# Altium schematic sheet eMMC FLASH.SchDoc
size A4
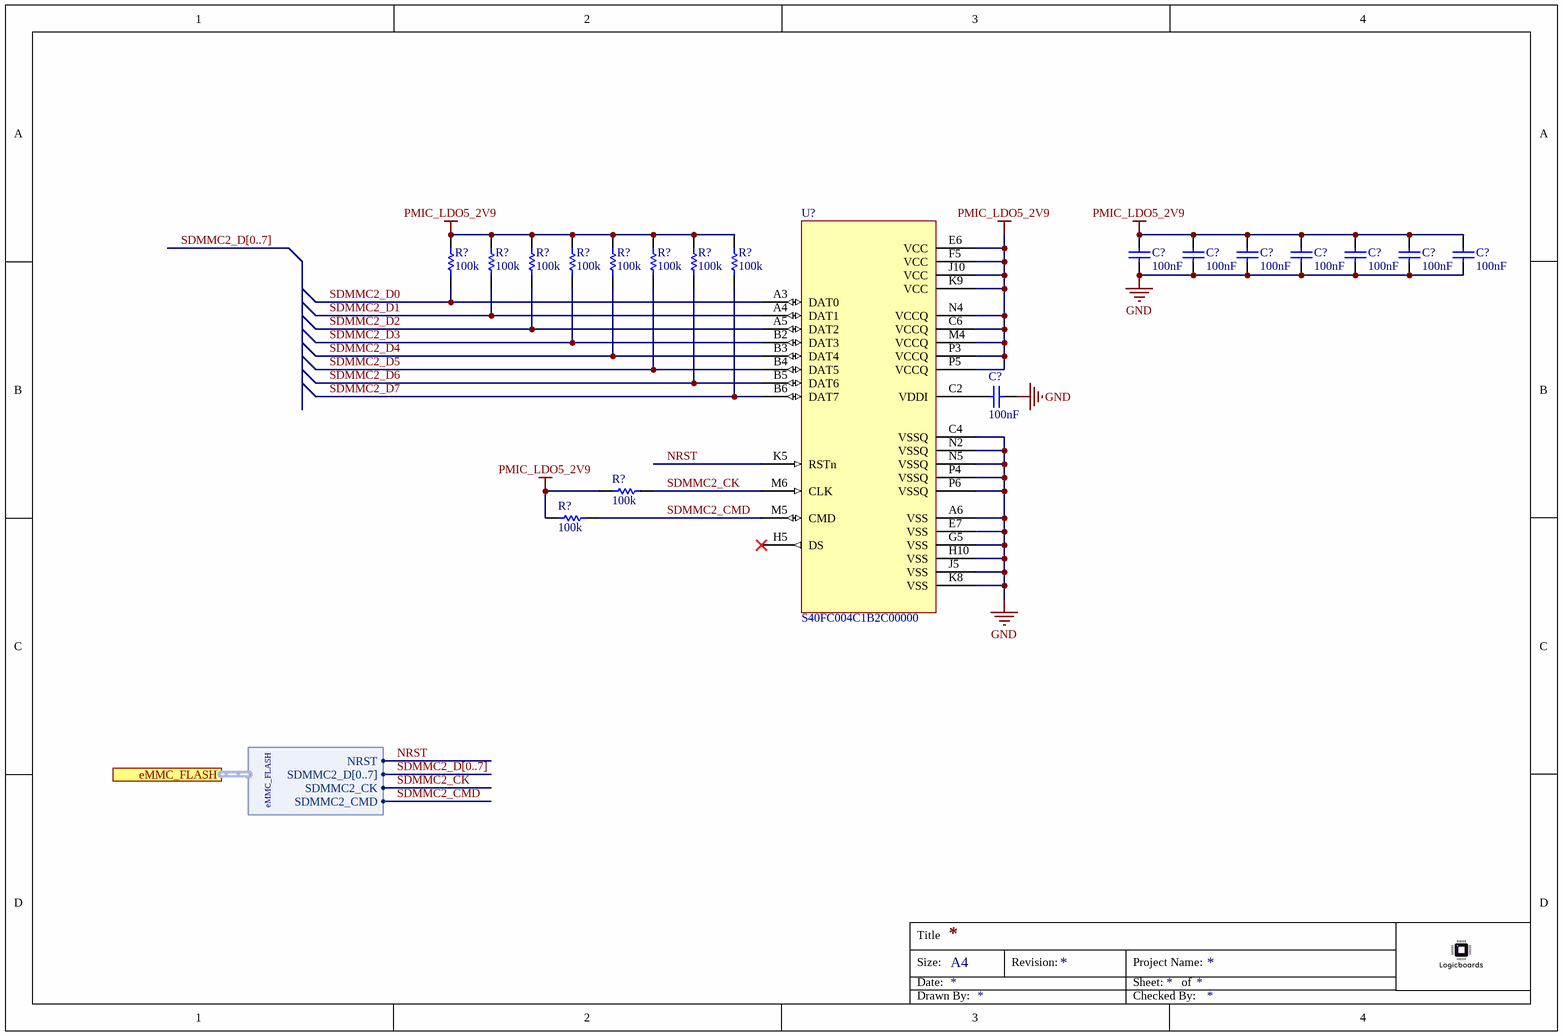
[diagram p0: eMMC FLASH.SchDoc]

## Parts
(Parts that share a designator on the sheet are numbered #1, #2 ... from top to bottom, then left to right.)
C?#1  100nF
C?#2  100nF
C?#3  100nF
C?#4  100nF
C?#5  100nF
C?#6  100nF
C?#7  100nF
C?#8  100nF
R?#1  100k
R?#2  100k
R?#3  100k
R?#4  100k
R?#5  100k
R?#6  100k
R?#7  100k
R?#8  100k
R?#9  100k
R?#10  100k
U?  S40FC004C1B2C00000

## Ports
eMMC_FLASH (harness eMMC_FLASH)

## Harnesses
eMMC_FLASH: SDMMC2_D[0..7], SDMMC2_CK, SDMMC2_CMD, NRST

## Nets
GND: C?#1.2 C?#2.2 C?#3.2 C?#4.2 C?#5.2 C?#6.2 C?#7.2 C?#8.1 U?.A6(VSS) U?.C4(VSSQ) U?.E7(VSS) U?.G5(VSS) U?.H10(VSS) U?.J5(VSS) U?.K8(VSS) U?.N2(VSSQ) U?.N5(VSSQ) U?.P4(VSSQ) U?.P6(VSSQ)
PMIC_LDO5_2V9: C?#1.1 C?#2.1 C?#3.1 C?#4.1 C?#5.1 C?#6.1 C?#7.1 R?#1.2 R?#2.2 R?#3.2 R?#4.2 R?#5.2 R?#6.2 R?#7.2 R?#8.2 R?#9.1 R?#10.1 U?.C6(VCCQ) U?.E6(VCC) U?.F5(VCC) U?.J10(VCC) U?.K9(VCC) U?.M4(VCCQ) U?.N4(VCCQ) U?.P3(VCCQ) U?.P5(VCCQ)
NRST: U?.K5(RSTn) ; port eMMC_FLASH.NRST
SDMMC2_CK: R?#9.2 U?.M6(CLK) ; port eMMC_FLASH.SDMMC2_CK
SDMMC2_CMD: R?#10.2 U?.M5(CMD) ; port eMMC_FLASH.SDMMC2_CMD
SDMMC2_D0: R?#1.1 U?.A3(DAT0)
SDMMC2_D1: R?#2.1 U?.A4(DAT1)
SDMMC2_D2: R?#3.1 U?.A5(DAT2)
SDMMC2_D3: R?#4.1 U?.B2(DAT3)
SDMMC2_D4: R?#5.1 U?.B3(DAT4)
SDMMC2_D5: R?#6.1 U?.B4(DAT5)
SDMMC2_D6: R?#7.1 U?.B5(DAT6)
SDMMC2_D7: R?#8.1 U?.B6(DAT7)
NetC?#8_2: C?#8.2 U?.C2(VDDI)

Not connected (* = marked no-connect by the designer): U? A1(NC) A2(NC) A7(RFU) A8(NC) A9(NC) A10(NC) A11(NC) A12(NC) A13(NC) A14(NC) B1(NC) B7(NC) B8(NC) B9(NC) B10(NC) B11(NC) B12(NC) B13(NC) B14(NC) C1(NC) C3(NC) C5(NC) C7(NC) C8(NC) C9(NC) C10(NC) C11(NC) C12(NC) C13(NC) C14(NC) D1(NC) D2(NC) D3(NC) D4(NC) D12(NC) D13(NC) D14(NC) E1(NC) E2(NC) E3(NC) E5(RFU) E8(RFU) E9(RFU) E10(RFU) E12(NC) E13(NC) E14(NC) F1(NC) F2(NC) F3(NC) F10(RFU) F12(NC) F13(NC) F14(NC) G1(NC) G2(NC) G3(RFU) G10(RFU) G12(NC) G13(NC) G14(NC) H1(NC) H2(NC) H3(NC) H5(DS)* H12(NC) H13(NC) H14(NC) J1(NC) J2(NC) J3(NC) J12(NC) J13(NC) J14(NC) K1(NC) K2(NC) K3(NC) K6(RFU) K7(RFU) K10(RFU) K12(NC) K13(NC) K14(NC) L1(NC) L2(NC) L3(NC) L12(NC) L13(NC) L14(NC) M1(NC) M2(NC) M3(NC) M7(NC) M8(NC) M9(NC) M10(NC) M11(NC) M12(NC) M13(NC) M14(NC) N1(NC) N3(NC) N6(NC) N7(NC) N8(NC) N9(NC) N10(NC) N11(NC) N12(NC) N13(NC) N14(NC) P1(NC) P2(NC) P7(RFU) P8(NC) P9(NC) P10(RFU) P11(NC) P12(NC) P13(NC) P14(NC)

## Buses and harness runs
bus SDMMC2_D[0..7]

## Notes on the sheet
- Title
- Size:
- Date:
- A4
- Revision:
- Sheet:
- Project Name:
- of
- Drawn By:
- Checked By:

## Library data of the parts
C?#1-C?#8 = CAP_SMD: Capacitor MLCC; Tolerance: 10%; Dielectric: X5R; Voltage Rating: 6.3V; Supplier 1: Mouser; Manufacturer 1: *; Manufacturer Part Number 1: *; RoHS: Yes; Mount: Surface Mount; Package: *; Capacitance: *; Length: *; Lead Free: Lead Free; Supplier Part Number 1: *; Supplier 2: Digikey; Supplier Part Number 2: *; Value: 100nF
R?#1-R?#10 = RES_SMD: General Purpose Chip Resistor Thick Film; Supplier 1: Mouser; RoHS: Yes; Category: Resistors; RoHS Compliant: Yes; Resistance: *; Supplier 2: Digikey; Supplier Part Number 2: *; Package: *; Value: 100k
U? = S40FC004C1B2C00000: IC eMMC 4GB, 3.3V Flash; Manufacturer 1: SKYHIGH MEMORY; Supplier 1: Mouser; Manufacturer Part Number 1: S40FC004C1B2C00000; RoHS: No; Pricing 1: 1=7.44000, 10=6.82000, 50=5.91000, 100=5.58000, 1000=4.19000, 10000=4.19000 (USD); Datasheet: http://www.skyhighmemory.com/download/dataSheet/002-01112.pdf; Supplier Part Number 1: 727-S40FC004C1B2C000; Supplier 2: Digikey; Supplier Part Number 2: *